# Altium project MachLedNhayTheoNhacNhieuCot.PrjPcb
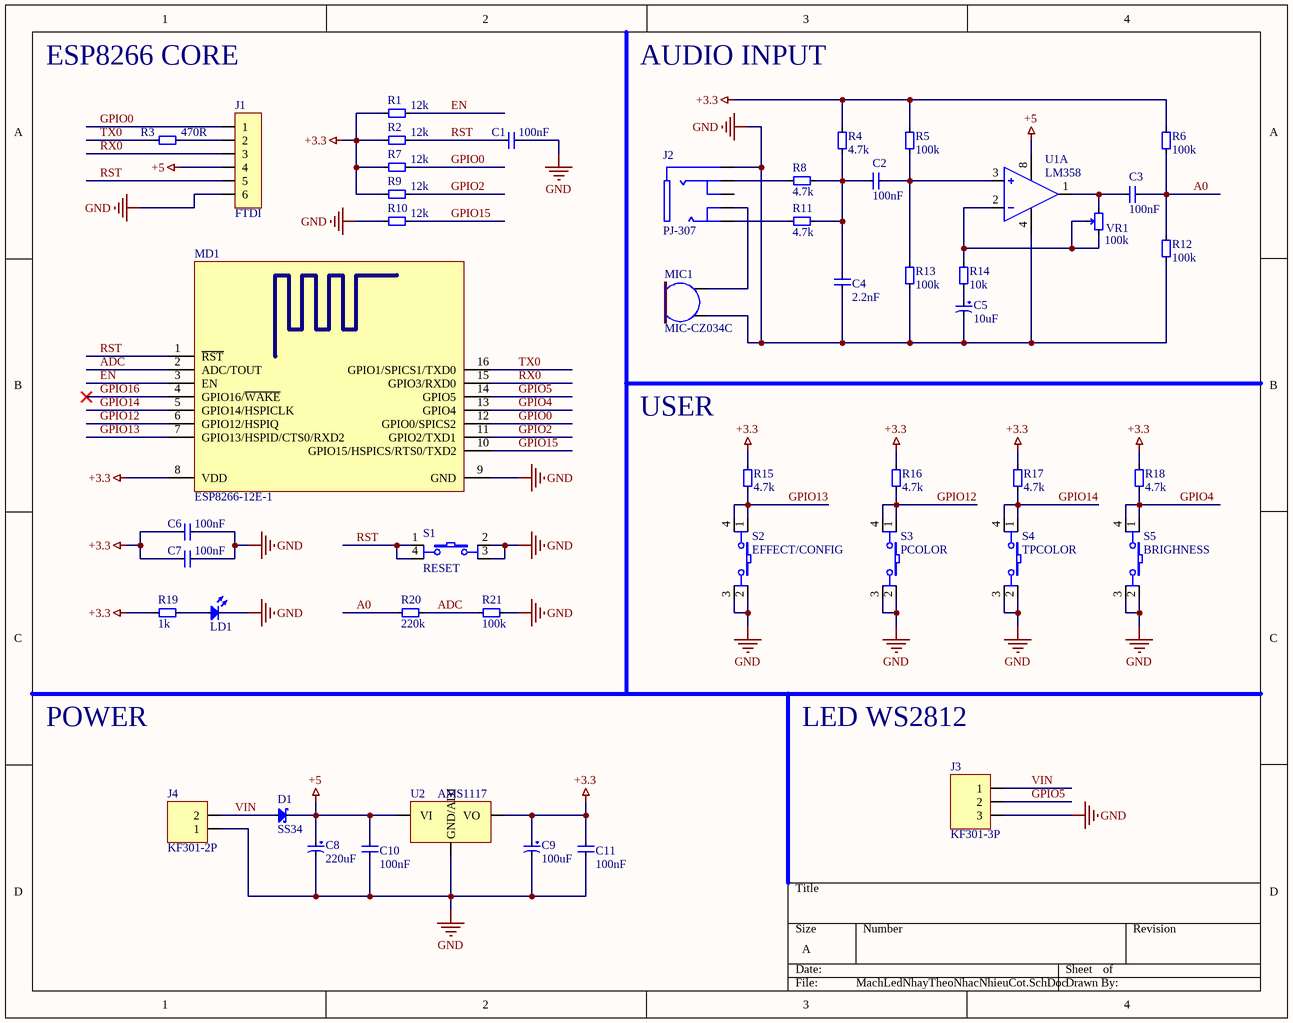
[diagram p0: MachLedNhayTheoNhacNhieuCot.SchDoc]
1 sheet, 48 parts. Net scope: global (net labels, ports and power ports of the same name join across sheets).
Board file: MachLedNhayTheoNhacNhieuCot.PcbDoc

## Sheet MachLedNhayTheoNhacNhieuCot.SchDoc
size A

### Parts
C1  100nF  [C-0805]
C2  100nF  [C-0805]
C3  100nF  [C-0805]
C4  2.2nF  [C-0805]
C5  10uF  [C-ELE-2-5X7MM]
C6  100nF  [C-0805]
C7  100nF  [C-0805]
C8  220uF  [C-ELE-2.5-6.3X12MM-A]
C9  100uF  [C-ELE-2.5-6.3X11MM-A]
C10  100nF  [C-0805]
C11  100nF  [C-0805]
D1  SS34  [DO-214AC-SMA]
J1  FTDI  [JP1X6M-2.54]
J2  PJ-307  [PJ-307]
J3  KF301-3P  [KF301-3P-5.0]
J4  KF301-2P  [KF301-2P-5.0]
LD1  PWR  [LED-0805-RED]  (value not drawn)
MD1  ESP8266-12E-1  [ESP8266-12E-1]
MIC1  MIC-CZ034C  [MIC-CZ034C]
R1  12k  [R-0805]
R2  12k  [R-0805]
R3  470R  [R-0805]
R4  4.7k  [R-0805]
R5  100k  [R-0805]
R6  100k  [R-0805]
R7  12k  [R-0805]
R8  4.7k  [R-0805]
R9  12k  [R-0805]
R10  12k  [R-0805]
R11  4.7k  [R-0805]
R12  100k  [R-0805]
R13  100k  [R-0805]
R14  10k  [R-0805]
R15  4.7k  [R-0805]
R16  4.7k  [R-0805]
R17  4.7k  [R-0805]
R18  4.7k  [R-0805]
R19  1k  [R-0805]
R20  220k  [R-0805]
R21  100k  [R-0805]
S1  RESET  [SW4P-DIP-6X6MM]
S2  EFFECT/CONFIG  [SW4P-DIP-6X6MM]
S3  PCOLOR  [SW4P-DIP-6X6MM]
S4  TPCOLOR  [SW4P-DIP-6X6MM]
S5  BRIGHNESS  [SW4P-DIP-6X6MM]
U1  LM358  [SO8-1.27-150MIL]  (part A of 2)
U2  AMS1117  [SOT223]
VR1  100k  [VR-ADJ-3362P]

### Nets
+3.3: C6.2 C7.2 C9.1 C11.2 MD1.8(VDD) R1.1 R2.1 R4.2 R5.2 R6.2 R7.1 R9.1 R15.2 R16.2 R17.2 R18.2 R19.1 U2.2(VO)
+5: C8.1 C10.2 D1.2 J1.4 U1.8(V+) U2.3(VI)
GND: C1.1 C4.2 C5.2 C6.1 C7.1 C8.2 C9.2 C10.1 C11.1 J1.6 J2.1 J3.3 J4.1 LD1.2 MD1.9(GND) MIC1.1 R10.1 R12.1 R13.1 R21.2 S1.2 S1.3 S2.2 S2.3 S3.2 S3.3 S4.2 S4.3 S5.2 S5.3 U1.4(V-) U2.1(GND/ADJ)
A0: C3.2 R6.1 R12.2 R20.1
ADC: MD1.2(ADC/TOUT) R20.2 R21.1
EN: MD1.3(EN) R1.2
GPIO0: J1.1 MD1.12(GPIO0/SPICS2) R7.2
GPIO2: MD1.11(GPIO2/TXD1) R9.2
GPIO4: MD1.13(GPIO4) R18.1 S5.1 S5.4
GPIO5: J3.2 MD1.14(GPIO5)
GPIO12: MD1.6(GPIO12/HSPIQ) R16.1 S3.1 S3.4
GPIO13: MD1.7(GPIO13/HSPID/CTS0/RXD2) R15.1 S2.1 S2.4
GPIO14: MD1.5(GPIO14/HSPICLK) R17.1 S4.1 S4.4
GPIO15: MD1.10(GPIO15/HSPICS/RTS0/TXD2) R10.2
GPIO16: MD1.4(GPIO16/~{WAKE})
RST: C1.2 J1.5 MD1.1(~{RST}) R2.2 S1.1 S1.4
RX0: J1.3 MD1.15(GPIO3/RXD0)
TX0: MD1.16(GPIO1/SPICS1/TXD0) R3.1
VIN: D1.1 J3.1 J4.2
NetC2_1: C2.1 C4.1 R4.1 R8.1 R11.1
NetC2_2: C2.2 R5.1 R13.2 U1.3(+INA)
NetC3_1: C3.1 U1.1(OUTA) VR1.3
NetC5_1: C5.1 R14.1
NetJ1_2: J1.2 R3.2
NetJ2_2: J2.2 R8.2
NetJ2_4: J2.4 MIC1.2
NetJ2_5: J2.5 R11.2
NetLD1_1: LD1.1 R19.2
NetR14_2: R14.2 U1.2(-INA) VR1.1 VR1.2

Not connected (* = marked no-connect by the designer): J2 3

### Notes on the sheet
- ESP8266 CORE
- AUDIO INPUT
- USER
- POWER
- LED WS2812

### Library data of the parts
C1-C4 C6 C7 C10 C11 = CAP: Cac Loai Tu Khong Phan Cuc
C5 C8 C9 = CAP-ELE: Cac Loai Tu Hoa
D1 = SS34: Diode Schottky 1N5822 3A 40V Dan
J1 = JP1X6-2.54: Jump Don 6 Chan 2.54mm
J2 = PJ-307: Jack Ket Noi Audio 3.5MM
J3 = KF301-3P: Dau Ket Noi KF301 3 Chan
J4 = KF301-2P: Dau Ket Noi KF301 2 Chan
LD1 = LED: Cac Loai LED Don
MD1 = ESP8266-12E-1: Module ESP8266-12E
MIC1 = MIC-CZ034C: Microphone CZ034C
R1-R21 = RES: Cac Loai Dien Tro
S1-S5 = SW4P-DIP-6X6MM: Nut Nhan 4 Chan 6X6MM
U1 = LM358: IC OPAM 2 Kenh
U2 = AMS1117: IC On Ap Tuyen Tinh AMS1117 1A
VR1 = VRES: Cac Loai Bien Tro